# EAGLE schematic unitbase_anayuki (EAGLE 9.6.2)

## Sheet 1 of 3
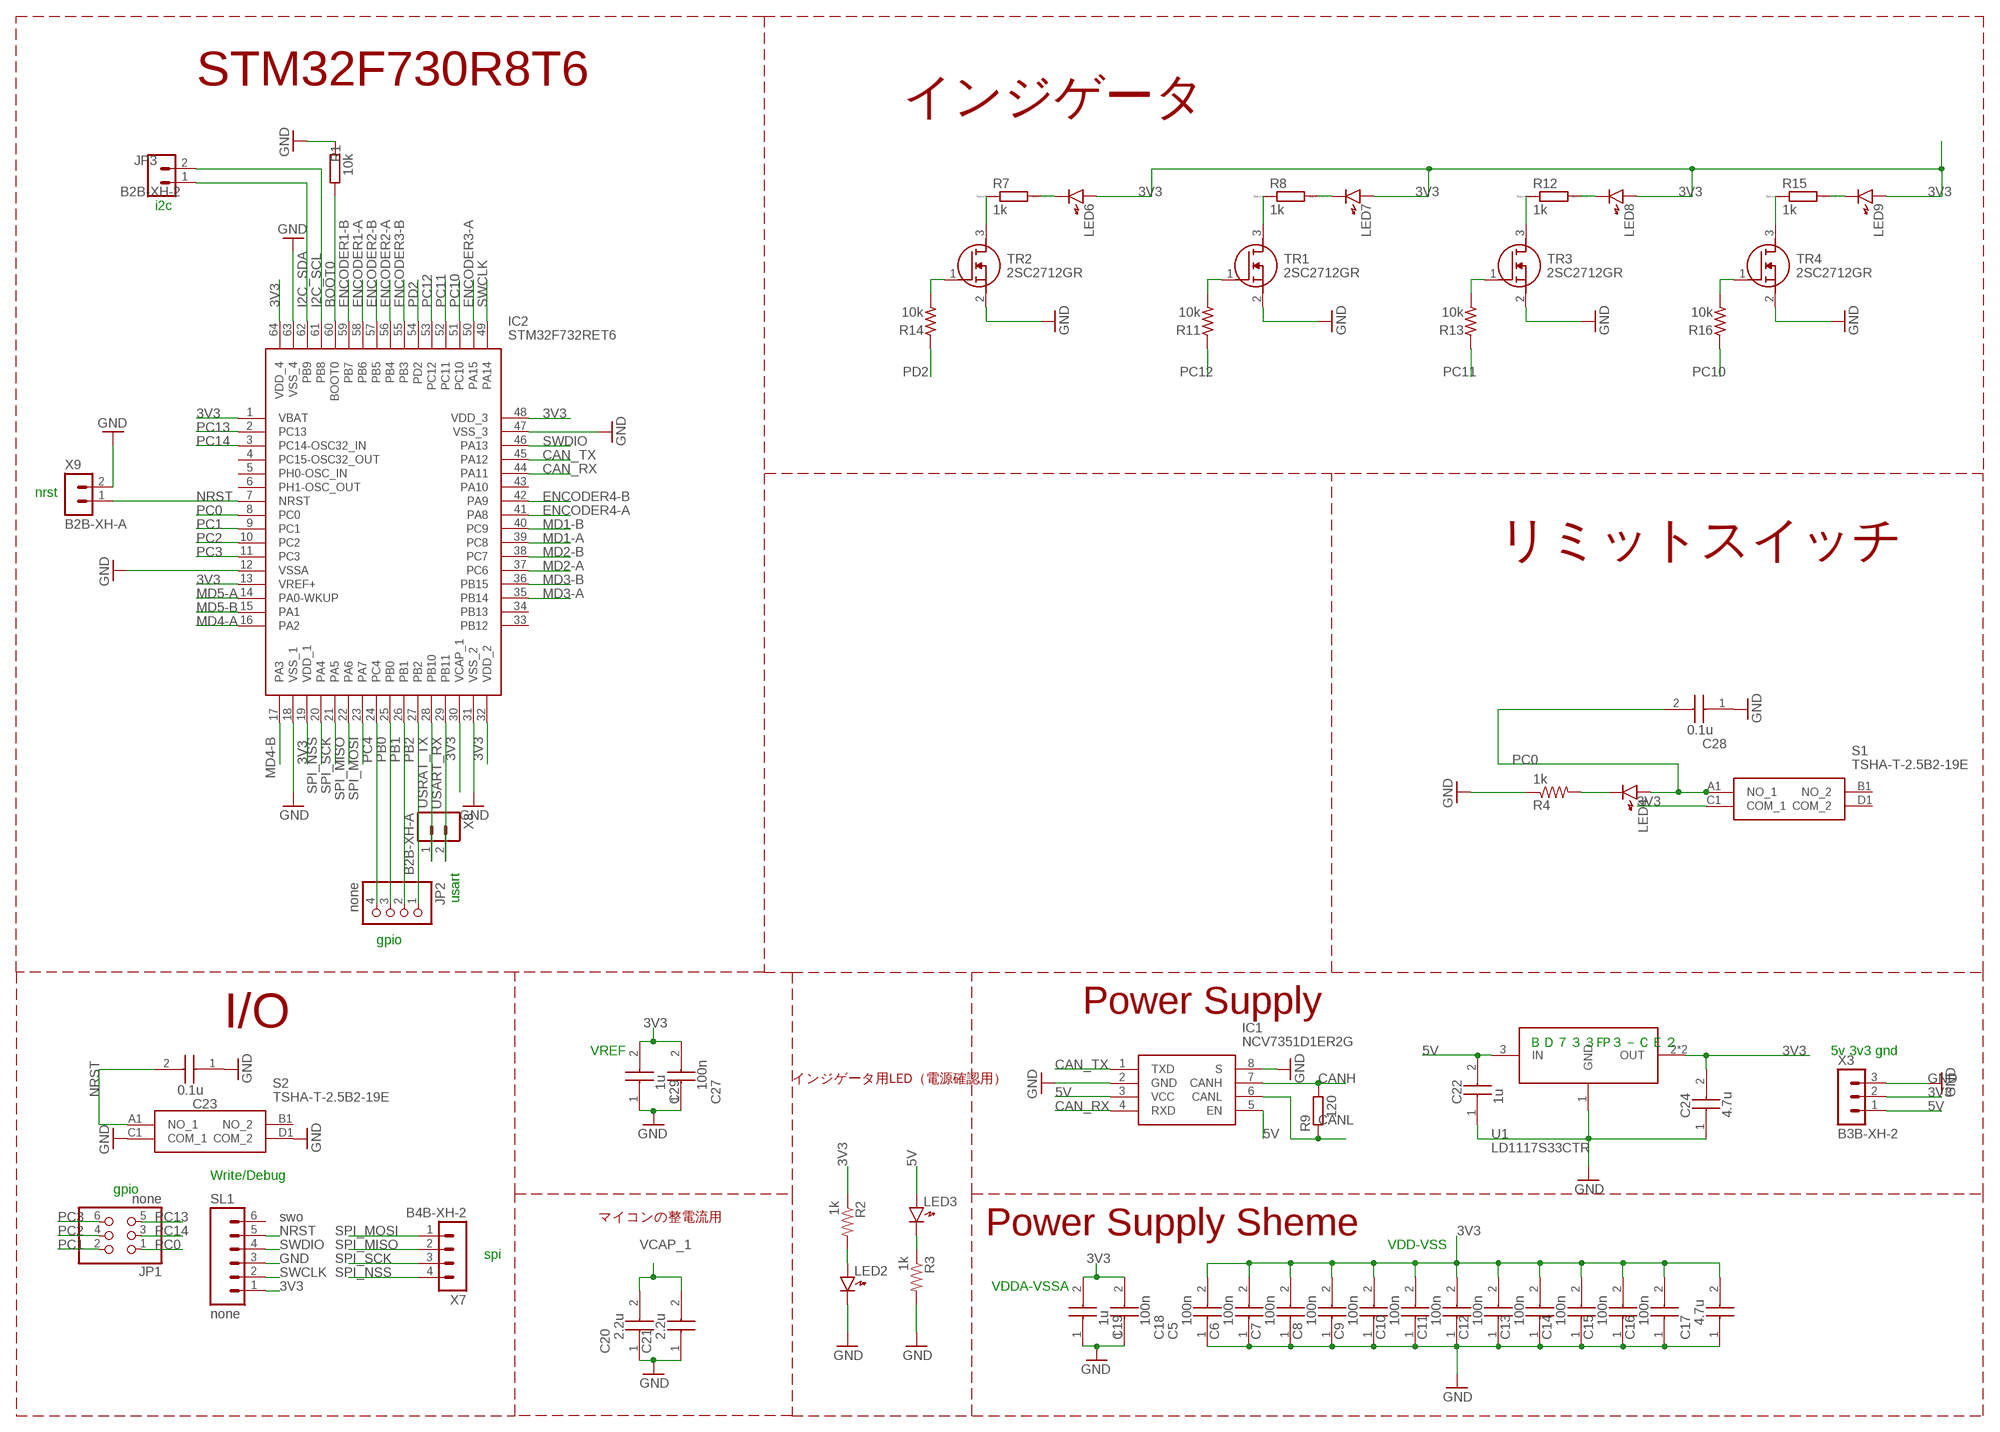
[diagram p0: schematic, sheet 1]

### Parts
C5  100n  AMK107BBJ476MA-RE  [CAPC1709X100N]
C6  100n  AMK107BBJ476MA-RE  [CAPC1709X100N]
C7  100n  AMK107BBJ476MA-RE  [CAPC1709X100N]
C8  100n  AMK107BBJ476MA-RE  [CAPC1709X100N]
C9  100n  AMK107BBJ476MA-RE  [CAPC1709X100N]
C10  100n  AMK107BBJ476MA-RE  [CAPC1709X100N]
C11  100n  AMK107BBJ476MA-RE  [CAPC1709X100N]
C12  100n  AMK107BBJ476MA-RE  [CAPC1709X100N]
C13  100n  AMK107BBJ476MA-RE  [CAPC1709X100N]
C14  100n  AMK107BBJ476MA-RE  [CAPC1709X100N]
C15  100n  AMK107BBJ476MA-RE  [CAPC1709X100N]
C16  100n  AMK107BBJ476MA-RE  [CAPC1709X100N]
C17  4.7u  AMK107BBJ476MA-RE  [CAPC1709X100N]
C18  100n  AMK107BBJ476MA-RE  [CAPC1709X100N]
C19  1u  AMK107BBJ476MA-RE  [CAPC1709X100N]
C20  2.2u  AMK107BBJ476MA-RE  [CAPC1709X100N]
C21  2.2u  AMK107BBJ476MA-RE  [CAPC1709X100N]
C22  1u  GRM188B31A106KE69D  [CAPC1608X90N]
C23  0.1u  AMK107BBJ476MA-RE  [CAPC1709X100N]
C24  4.7u  GRM188B31A106KE69D  [CAPC1608X90N]
C27  100n  AMK107BBJ476MA-RE  [CAPC1709X100N]
C28  0.1u  AMK107BBJ476MA-RE  [CAPC1709X100N]
C29  1u  AMK107BBJ476MA-RE  [CAPC1709X100N]
IC1  NCV7351D1ER2G  [SOIC127P600X175-8N]
IC2  STM32F732RET6  [QFP50P1200X1200X160-64N]
JP1  none  PINHD-2X3  [2X03]
JP2  none  PINHD-1X4  [1X04]
JP3  B2B-XH-2  [B2B-XH-A]
LED2  LED1608  [LED1608]
LED3  LED1608  [LED1608]
LED4  LED1608  [LED1608]
LED6  LED1608  [LED1608]
LED7  LED1608  [LED1608]
LED8  LED1608  [LED1608]
LED9  LED1608  [LED1608]
R1  10k  R1608  [1608]
R2  1k  R-US_R0603  [R0603]
R3  1k  R-US_R0603  [R0603]
R4  1k  R-US_R0603  [R0603]
R7  1k  RR0603  [R0603]
R8  1k  RR0603  [R0603]
R9  120  R1608  [1608]
R11  10k  RESISTOR-US1608  [SMD1608]
R12  1k  RR0603  [R0603]
R13  10k  RESISTOR-US1608  [SMD1608]
R14  10k  RESISTOR-US1608  [SMD1608]
R15  1k  RR0603  [R0603]
R16  10k  RESISTOR-US1608  [SMD1608]
S1  TSHA-T-2.5B2-19E  [TSHAT25B219E]
S2  TSHA-T-2.5B2-19E  [TSHAT25B219E]
SL1  none  MA06  [06PA]
TR1  2SC2712GR  SOT-23_NMOS  [SOT-23]
TR2  2SC2712GR  SOT-23_NMOS  [SOT-23]
TR3  2SC2712GR  SOT-23_NMOS  [SOT-23]
TR4  2SC2712GR  SOT-23_NMOS  [SOT-23]
U1  LD1117S33CTR  [SOT223]
X3  B3B-XH-2  [B3B-XH-A]
X7  B4B-XH-2  [B4B-XH-A]
X8  B2B-XH-A  [B2B-XH-A]
X9  B2B-XH-A  [B2B-XH-A]

### Nets
3V3: C5.2 C6.2 C7.2 C8.2 C9.2 C10.2 C11.2 C12.2 C13.2 C14.2 C15.2 C16.2 C17.2 C18.2 C19.2 C24.2 C27.2 C29.2 IC2.1(VBAT) IC2.13(VREF+) IC2.19(VDD_1) IC2.30(VCAP_1) IC2.32(VDD_2) IC2.48(VDD_3) IC2.64(VDD_4) LED6.A LED7.A LED8.A LED9.A R2.1 S1.C1(COM_1) SL1.1 U1.2(OUT) U1.4(OUT) X3.2 ; also sheet 3
5V: C22.2 IC1.3(VCC) IC1.5(EN) LED3.A U1.3(IN) X3.1 ; also sheet 2,3
BOOT0: IC2.60(BOOT0) R1.1
CAN_RX [CANRX/TX]: IC1.4(RXD) IC2.44(PA11)
CAN_TX [CANRX/TX]: IC1.1(TXD) IC2.45(PA12)
CANH [CAN]: IC1.7(CANH) R9.2 ; also sheet 3
CANL [CAN]: IC1.6(CANL) R9.1 ; also sheet 3
ENCODER1-A: IC2.58(PB6) ; also sheet 2
ENCODER1-B: IC2.59(PB7) ; also sheet 2
ENCODER2-A: IC2.56(PB4) ; also sheet 2
ENCODER2-B: IC2.57(PB5) ; also sheet 2
ENCODER3-A: IC2.50(PA15) ; also sheet 2
ENCODER3-B: IC2.55(PB3) ; also sheet 2
ENCODER4-A: IC2.41(PA8) ; also sheet 2
ENCODER4-B: IC2.42(PA9) ; also sheet 2
GND: C5.1 C6.1 C7.1 C8.1 C9.1 C10.1 C11.1 C12.1 C13.1 C14.1 C15.1 C16.1 C17.1 C18.1 C19.1 C20.1 C21.1 C22.1 C23.1 C24.1 C27.1 C28.1 C29.1 IC1.2(GND) IC1.8(S) IC2.12(VSSA) IC2.18(VSS_1) IC2.31(VSS_2) IC2.47(VSS_3) IC2.63(VSS_4) LED2.K R1.2 R3.2 R4.1 S2.C1(COM_1) S2.D1(COM_2) SL1.3 TR1.2(S) TR2.2(S) TR3.2(S) TR4.2(S) U1.1(GND) X3.3 X9.2 ; also sheet 2,3
I2C_SCL: IC2.61(PB8) JP3.2
I2C_SDA: IC2.62(PB9) JP3.1
MD1-A: IC2.39(PC8) ; also sheet 3
MD1-B: IC2.40(PC9) ; also sheet 3
MD2-A: IC2.37(PC6) ; also sheet 3
MD2-B: IC2.38(PC7) ; also sheet 3
MD3-A: IC2.35(PB14) ; also sheet 3
MD3-B: IC2.36(PB15) ; also sheet 3
MD4-A: IC2.16(PA2) ; also sheet 3
MD4-B: IC2.17(PA3) ; also sheet 3
MD5-A: IC2.14(PA0-WKUP) ; also sheet 3
MD5-B: IC2.15(PA1) ; also sheet 3
N$7: LED2.A R2.2
N$8: LED3.K R3.1
N$16: LED4.K R4.2
N$22: LED6.K R7.2
N$23: R14.2 TR2.1(G)
N$25: R7.1 TR2.3(D)
N$26: LED7.K R8.2
N$27: R11.2 TR1.1(G)
N$28: R8.1 TR1.3(D)
N$30: LED8.K R12.2
N$31: R13.2 TR3.1(G)
N$33: R12.1 TR3.3(D)
N$39: LED9.K R15.2
N$40: R16.2 TR4.1(G)
N$41: R15.1 TR4.3(D)
NRST: C23.2 IC2.7(NRST) S2.A1(NO_1) SL1.5 X9.1
PB0: IC2.25(PB0) JP2.3 ; also sheet 3
PB1: IC2.26(PB1) JP2.2 ; also sheet 3
PB2: IC2.27(PB2) JP2.1
PC0: C28.2 IC2.8(PC0) JP1.1 LED4.A S1.A1(NO_1)
PC1: IC2.9(PC1) JP1.2
PC2: IC2.10(PC2) JP1.4
PC3: IC2.11(PC3) JP1.6
PC4: IC2.24(PC4) JP2.4
PC10: IC2.51(PC10) R16.1
PC11: IC2.52(PC11) R13.1
PC12: IC2.53(PC12) R11.1
PC13: IC2.2(PC13) JP1.5
PC14: IC2.3(PC14-OSC32_IN) JP1.3
PD2: IC2.54(PD2) R14.1
SPI_MISO: IC2.22(PA6) X7.2
SPI_MOSI: IC2.23(PA7) X7.1
SPI_NSS: IC2.20(PA4) X7.4
SPI_SCK: IC2.21(PA5) X7.3
SWCLK: IC2.49(PA14) SL1.2
SWDIO: IC2.46(PA13) SL1.4
USART_RX: IC2.29(PB11) X8.2
USRAT_TX: IC2.28(PB10) X8.1
VCAP_1: C20.2 C21.2
Unconnected: IC2.4(PC15-OSC32_OUT) IC2.5(PH0-OSC_IN) IC2.6(PH1-OSC_OUT) IC2.33(PB12) IC2.34(PB13) IC2.43(PA10) S1.B1(NO_2) S1.D1(COM_2) S2.B1(NO_2) SL1.6

### Notes on the sheet
- STM32F730R8T6
- インジゲータ
- i2c
- nrst
- リミットスイッチ
- usart
- gpio
- Power Supply
- I/O
- ＢＤ７３３FP３－ＣＥ２
- VREF | 5v 3v3 gnd
- インジゲータ用LED（電源確認用）
- Write/Debug
- gpio
- swo | マイコンの整電流用
- Power Supply Sheme
- spi | VDD-VSS
- VDDA-VSSA

## Sheet 2 of 3
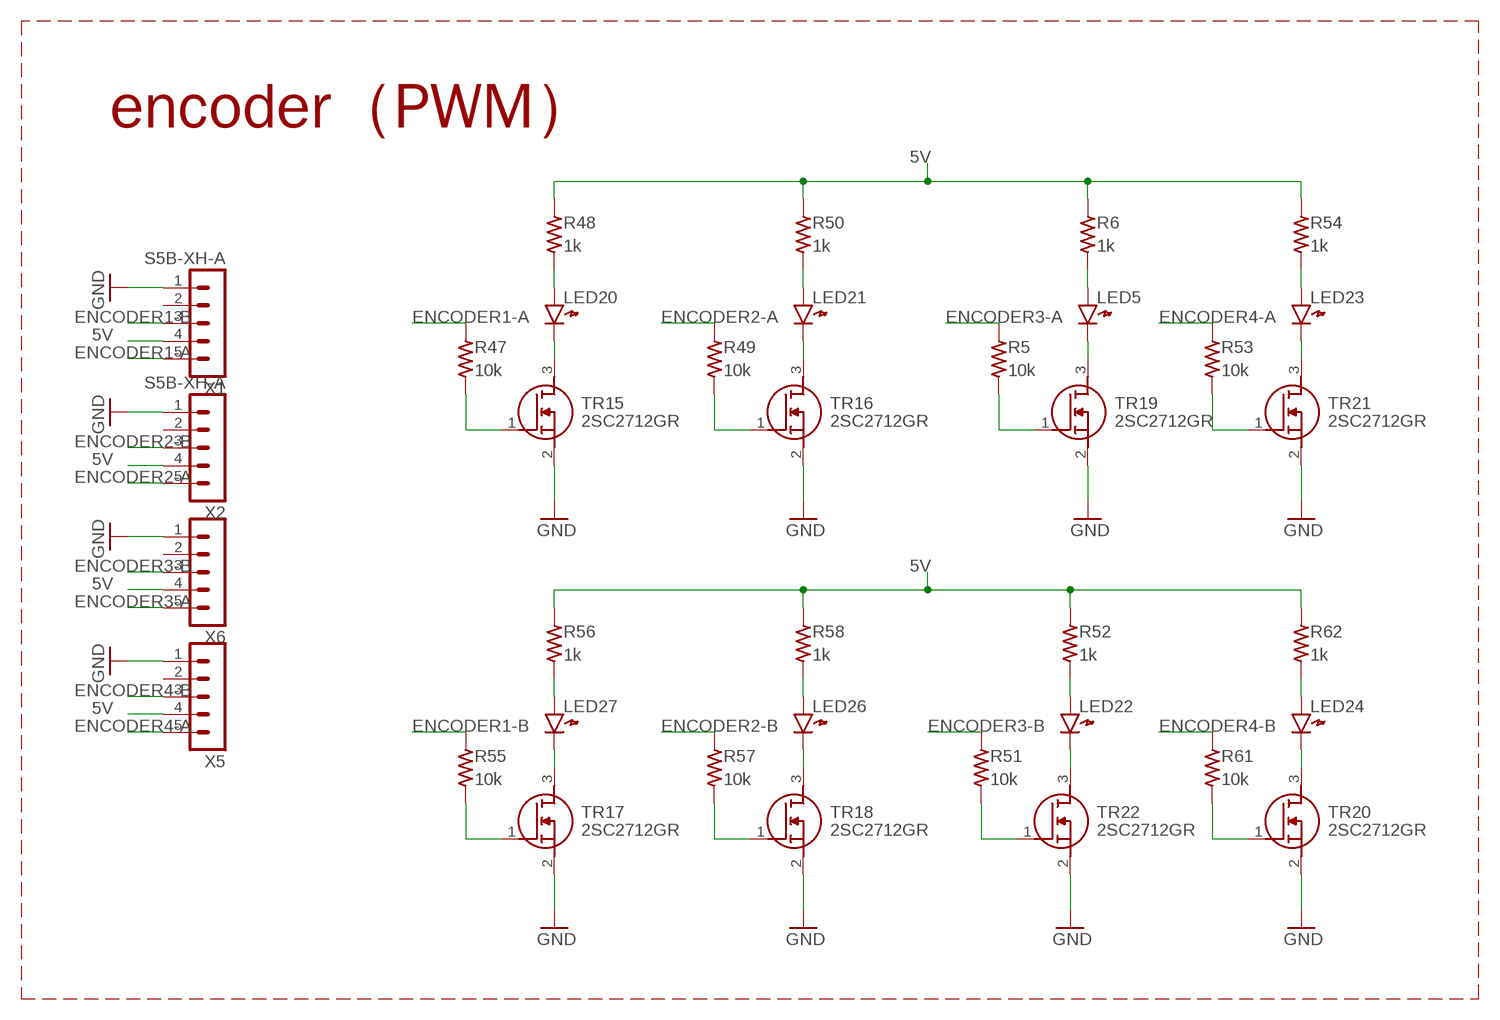
[diagram p1: schematic, sheet 2]

### Parts
LED5  LED1608  [LED1608]
LED20  LED1608  [LED1608]
LED21  LED1608  [LED1608]
LED22  LED1608  [LED1608]
LED23  LED1608  [LED1608]
LED24  LED1608  [LED1608]
LED26  LED1608  [LED1608]
LED27  LED1608  [LED1608]
R5  10k  RESISTOR-US1608  [SMD1608]
R6  1k  RESISTOR-US1608  [SMD1608]
R47  10k  RESISTOR-US1608  [SMD1608]
R48  1k  RESISTOR-US1608  [SMD1608]
R49  10k  RESISTOR-US1608  [SMD1608]
R50  1k  RESISTOR-US1608  [SMD1608]
R51  10k  RESISTOR-US1608  [SMD1608]
R52  1k  RESISTOR-US1608  [SMD1608]
R53  10k  RESISTOR-US1608  [SMD1608]
R54  1k  RESISTOR-US1608  [SMD1608]
R55  10k  RESISTOR-US1608  [SMD1608]
R56  1k  RESISTOR-US1608  [SMD1608]
R57  10k  RESISTOR-US1608  [SMD1608]
R58  1k  RESISTOR-US1608  [SMD1608]
R61  10k  RESISTOR-US1608  [SMD1608]
R62  1k  RESISTOR-US1608  [SMD1608]
TR15  2SC2712GR  SOT-23_NMOS  [SOT-23]
TR16  2SC2712GR  SOT-23_NMOS  [SOT-23]
TR17  2SC2712GR  SOT-23_NMOS  [SOT-23]
TR18  2SC2712GR  SOT-23_NMOS  [SOT-23]
TR19  2SC2712GR  SOT-23_NMOS  [SOT-23]
TR20  2SC2712GR  SOT-23_NMOS  [SOT-23]
TR21  2SC2712GR  SOT-23_NMOS  [SOT-23]
TR22  2SC2712GR  SOT-23_NMOS  [SOT-23]
X1  S5B-XH-A  [S5B-XH-A]
X2  S5B-XH-A  [S5B-XH-A]
X5  S5B-XH-A  [S5B-XH-A]
X6  S5B-XH-A  [S5B-XH-A]

### Nets
5V: R6.1 R48.1 R50.1 R52.1 R54.1 R56.1 R58.1 R62.1 X1.4 X2.4 X5.4 X6.4 ; also sheet 1,3
ENCODER1-A: R47.1 X1.5 ; also sheet 1
ENCODER1-B: R55.1 X1.3 ; also sheet 1
ENCODER2-A: R49.1 X2.5 ; also sheet 1
ENCODER2-B: R57.1 X2.3 ; also sheet 1
ENCODER3-A: R5.1 X6.5 ; also sheet 1
ENCODER3-B: R51.1 X6.3 ; also sheet 1
ENCODER4-A: R53.1 X5.5 ; also sheet 1
ENCODER4-B: R61.1 X5.3 ; also sheet 1
GND: TR15.2(S) TR16.2(S) TR17.2(S) TR18.2(S) TR19.2(S) TR20.2(S) TR21.2(S) TR22.2(S) X1.1 X2.1 X5.1 X6.1 ; also sheet 1,3
N$1: LED20.K TR15.3(D)
N$2: LED20.A R48.2
N$3: R49.2 TR16.1(G)
N$4: R47.2 TR15.1(G)
N$5: LED21.K TR16.3(D)
N$6: LED21.A R50.2
N$10: R53.2 TR21.1(G)
N$13: LED23.K TR21.3(D)
N$14: R5.2 TR19.1(G)
N$15: LED5.K TR19.3(D)
N$17: LED5.A R6.2
N$18: R51.2 TR22.1(G)
N$19: LED22.K TR22.3(D)
N$20: LED22.A R52.2
N$24: LED23.A R54.2
N$29: R55.2 TR17.1(G)
N$32: LED27.K TR17.3(D)
N$34: LED27.A R56.2
N$35: R57.2 TR18.1(G)
N$36: LED26.K TR18.3(D)
N$37: LED26.A R58.2
N$51: R61.2 TR20.1(G)
N$53: LED24.K TR20.3(D)
N$57: LED24.A R62.2
Unconnected: X1.2 X2.2 X5.2 X6.2

### Notes on the sheet
- encoder（PWM）

## Sheet 3 of 3
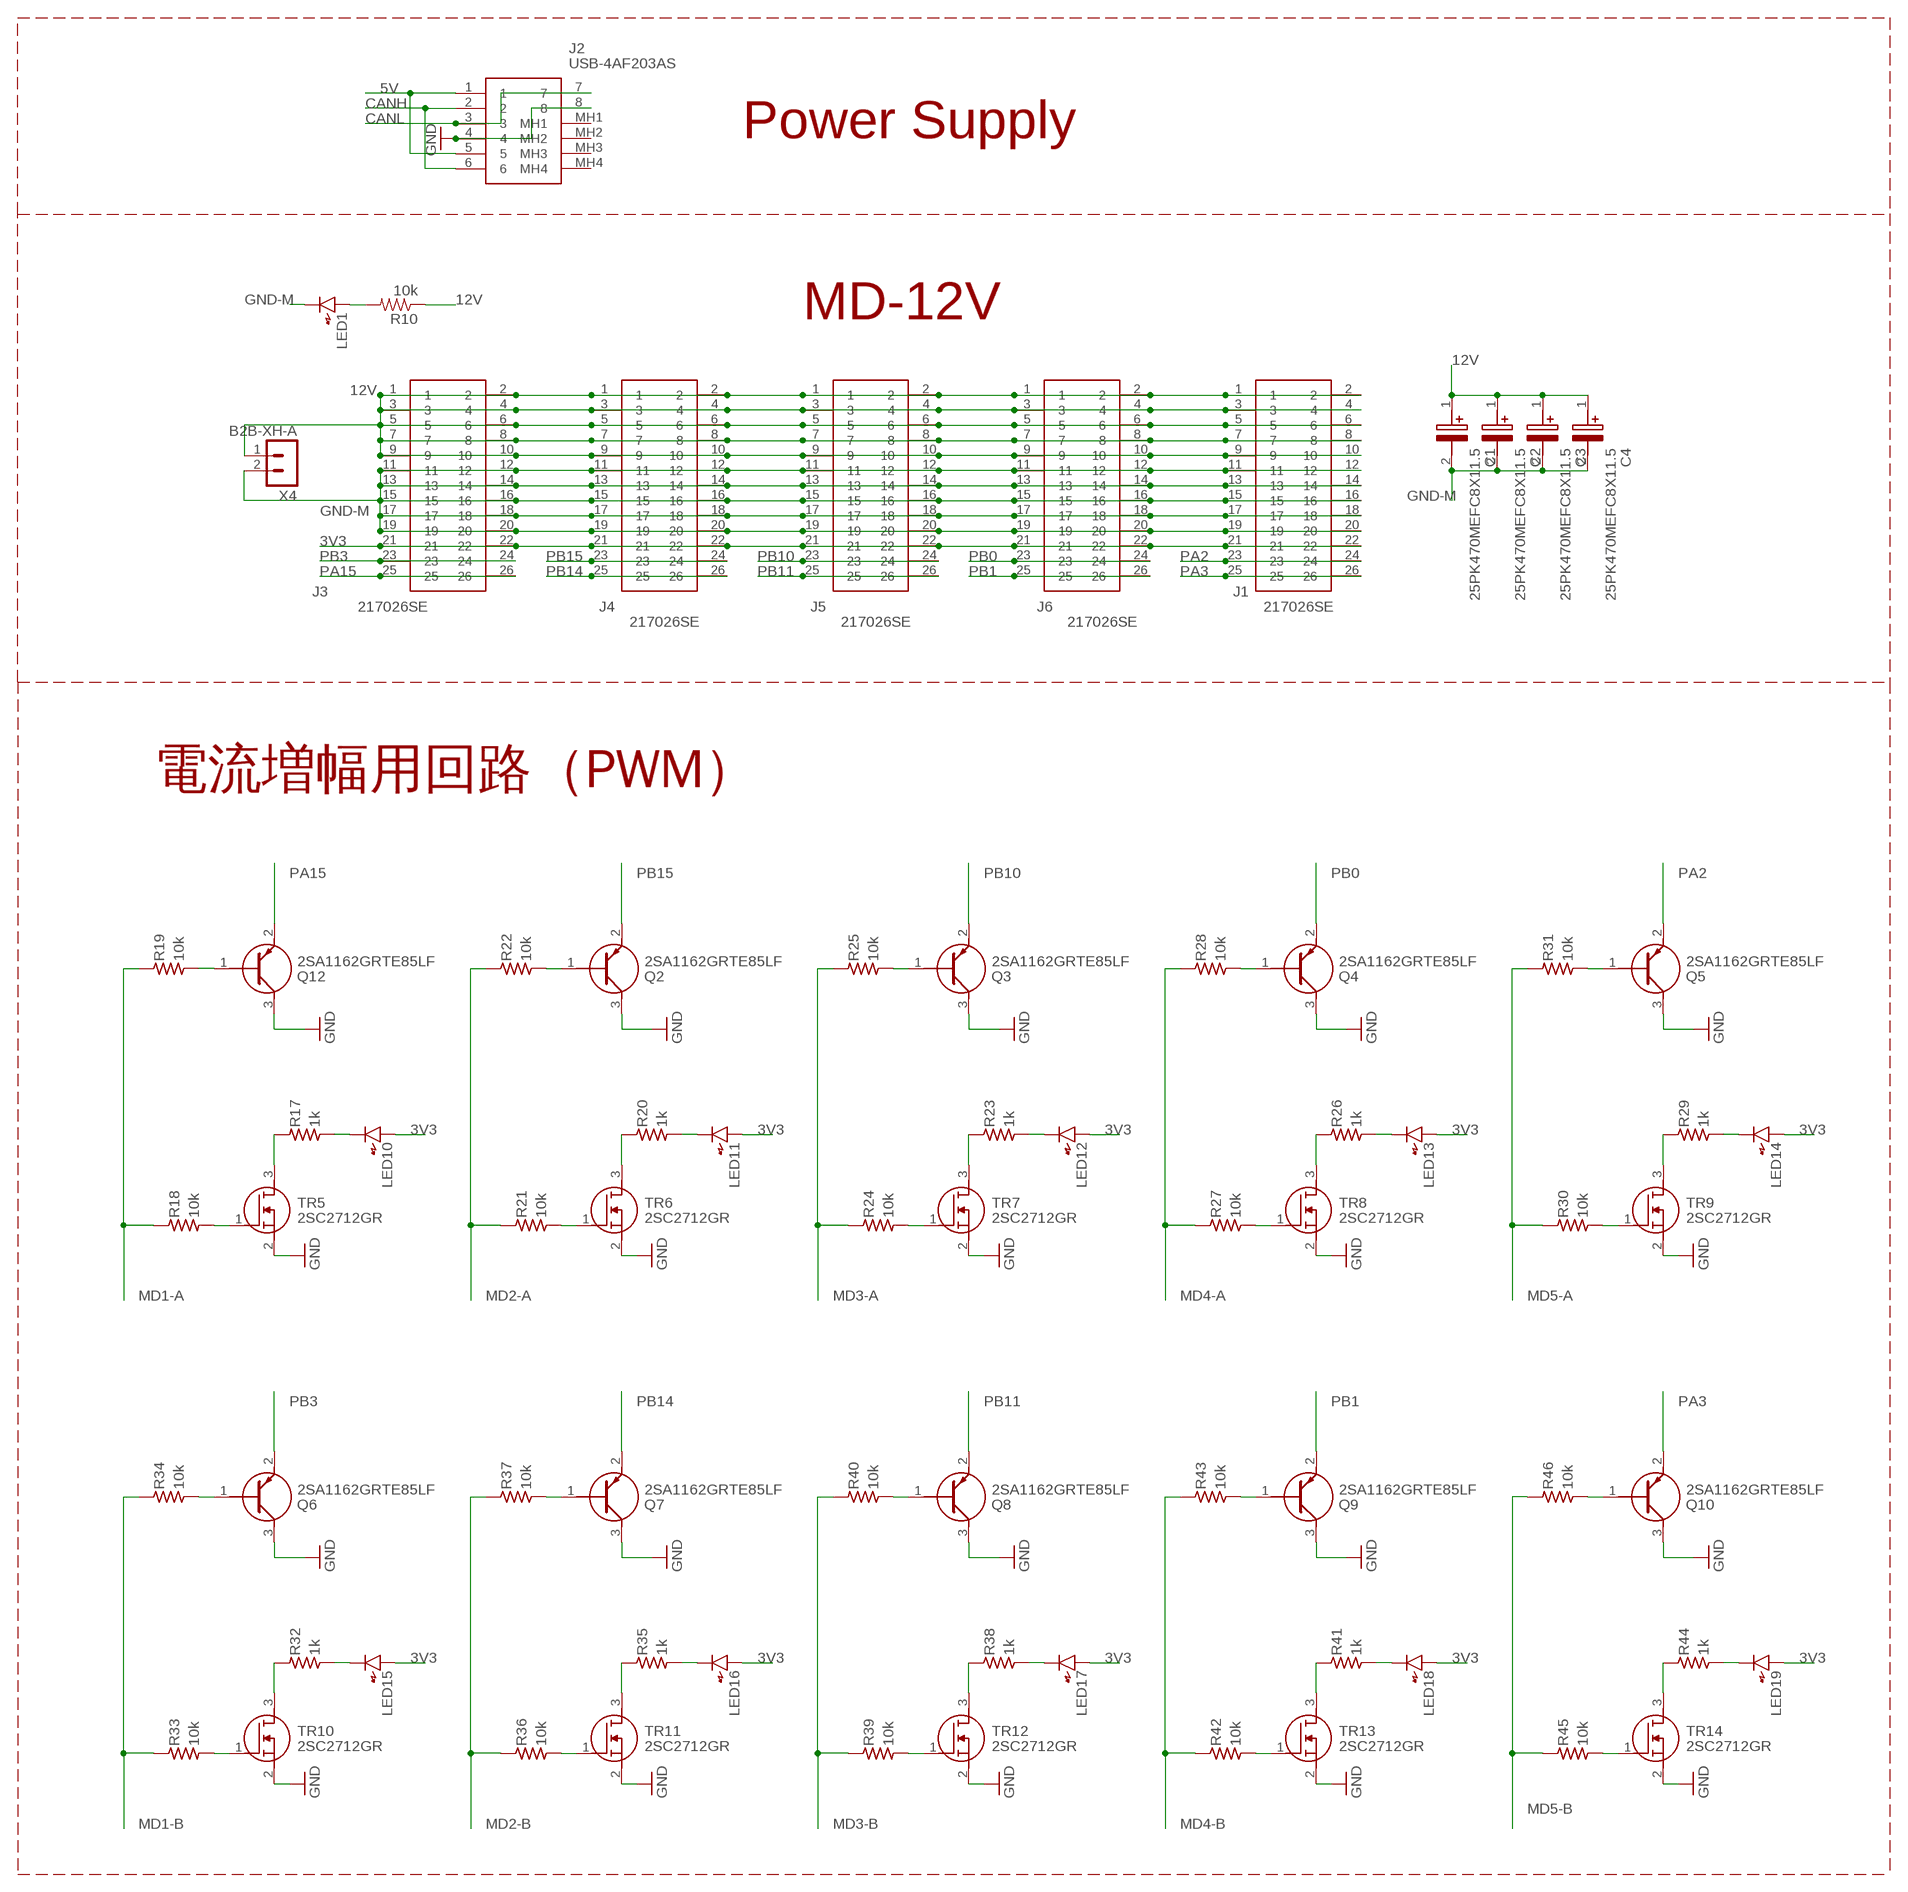
[diagram p2: schematic, sheet 3]

### Parts
C1  25PK470MEFC8X11.5  [CAPPRD350W60D825H1150]
C2  25PK470MEFC8X11.5  [CAPPRD350W60D825H1150]
C3  25PK470MEFC8X11.5  [CAPPRD350W60D825H1150]
C4  25PK470MEFC8X11.5  [CAPPRD350W60D825H1150]
J1  217026SE  [217026SE]
J2  USB-4AF203AS  [USB4AF203AS]
J3  217026SE  [217026SE]
J4  217026SE  [217026SE]
J5  217026SE  [217026SE]
J6  217026SE  [217026SE]
LED1  LED1608  [LED1608]
LED10  LED1608  [LED1608]
LED11  LED1608  [LED1608]
LED12  LED1608  [LED1608]
LED13  LED1608  [LED1608]
LED14  LED1608  [LED1608]
LED15  LED1608  [LED1608]
LED16  LED1608  [LED1608]
LED17  LED1608  [LED1608]
LED18  LED1608  [LED1608]
LED19  LED1608  [LED1608]
Q2  2SA1162GRTE85LF  [2SA1162GRTE85LF]
Q3  2SA1162GRTE85LF  [2SA1162GRTE85LF]
Q4  2SA1162GRTE85LF  [2SA1162GRTE85LF]
Q5  2SA1162GRTE85LF  [2SA1162GRTE85LF]
Q6  2SA1162GRTE85LF  [2SA1162GRTE85LF]
Q7  2SA1162GRTE85LF  [2SA1162GRTE85LF]
Q8  2SA1162GRTE85LF  [2SA1162GRTE85LF]
Q9  2SA1162GRTE85LF  [2SA1162GRTE85LF]
Q10  2SA1162GRTE85LF  [2SA1162GRTE85LF]
Q12  2SA1162GRTE85LF  [2SA1162GRTE85LF]
R10  10k  R-US_R0603  [R0603]
R17  1k  RESISTOR-US1608  [SMD1608]
R18  10k  RESISTOR-US1608  [SMD1608]
R19  10k  RESISTOR-US1608  [SMD1608]
R20  1k  RESISTOR-US1608  [SMD1608]
R21  10k  RESISTOR-US1608  [SMD1608]
R22  10k  RESISTOR-US1608  [SMD1608]
R23  1k  RESISTOR-US1608  [SMD1608]
R24  10k  RESISTOR-US1608  [SMD1608]
R25  10k  RESISTOR-US1608  [SMD1608]
R26  1k  RESISTOR-US1608  [SMD1608]
R27  10k  RESISTOR-US1608  [SMD1608]
R28  10k  RESISTOR-US1608  [SMD1608]
R29  1k  RESISTOR-US1608  [SMD1608]
R30  10k  RESISTOR-US1608  [SMD1608]
R31  10k  RESISTOR-US1608  [SMD1608]
R32  1k  RESISTOR-US1608  [SMD1608]
R33  10k  RESISTOR-US1608  [SMD1608]
R34  10k  RESISTOR-US1608  [SMD1608]
R35  1k  RESISTOR-US1608  [SMD1608]
R36  10k  RESISTOR-US1608  [SMD1608]
R37  10k  RESISTOR-US1608  [SMD1608]
R38  1k  RESISTOR-US1608  [SMD1608]
R39  10k  RESISTOR-US1608  [SMD1608]
R40  10k  RESISTOR-US1608  [SMD1608]
R41  1k  RESISTOR-US1608  [SMD1608]
R42  10k  RESISTOR-US1608  [SMD1608]
R43  10k  RESISTOR-US1608  [SMD1608]
R44  1k  RESISTOR-US1608  [SMD1608]
R45  10k  RESISTOR-US1608  [SMD1608]
R46  10k  RESISTOR-US1608  [SMD1608]
TR5  2SC2712GR  SOT-23_NMOS  [SOT-23]
TR6  2SC2712GR  SOT-23_NMOS  [SOT-23]
TR7  2SC2712GR  SOT-23_NMOS  [SOT-23]
TR8  2SC2712GR  SOT-23_NMOS  [SOT-23]
TR9  2SC2712GR  SOT-23_NMOS  [SOT-23]
TR10  2SC2712GR  SOT-23_NMOS  [SOT-23]
TR11  2SC2712GR  SOT-23_NMOS  [SOT-23]
TR12  2SC2712GR  SOT-23_NMOS  [SOT-23]
TR13  2SC2712GR  SOT-23_NMOS  [SOT-23]
TR14  2SC2712GR  SOT-23_NMOS  [SOT-23]
X4  B2B-XH-A  [B2B-XH-A]

### Nets
3V3: J1.21 J1.22 J3.21 J3.22 J4.21 J4.22 J5.21 J5.22 J6.21 J6.22 LED10.A LED11.A LED12.A LED13.A LED14.A LED15.A LED16.A LED17.A LED18.A LED19.A ; also sheet 1
5V: J2.1 J2.5 ; also sheet 1,2
12V: C1.1(+) C2.1(+) C3.1(+) C4.1(+) J1.1 J1.2 J1.3 J1.4 J1.5 J1.6 J1.7 J1.8 J1.9 J1.10 J3.1 J3.2 J3.3 J3.4 J3.5 J3.6 J3.7 J3.8 J3.9 J3.10 J4.1 J4.2 J4.3 J4.4 J4.5 J4.6 J4.7 J4.8 J4.9 J4.10 J5.1 J5.2 J5.3 J5.4 J5.5 J5.6 J5.7 J5.8 J5.9 J5.10 J6.1 J6.2 J6.3 J6.4 J6.5 J6.6 J6.7 J6.8 J6.9 J6.10 R10.1 X4.1
CANH [CAN]: J2.2 J2.6 ; also sheet 1
CANL [CAN]: J2.3 J2.7 ; also sheet 1
GND: J2.4 J2.8 Q2.3(C) Q3.3(C) Q4.3(C) Q5.3(C) Q6.3(C) Q7.3(C) Q8.3(C) Q9.3(C) Q10.3(C) Q12.3(C) TR5.2(S) TR6.2(S) TR7.2(S) TR8.2(S) TR9.2(S) TR10.2(S) TR11.2(S) TR12.2(S) TR13.2(S) TR14.2(S) ; also sheet 1,2
GND-M: C1.2(-) C2.2(-) C3.2(-) C4.2(-) J1.11 J1.12 J1.13 J1.14 J1.15 J1.16 J1.17 J1.18 J1.19 J1.20 J3.11 J3.12 J3.13 J3.14 J3.15 J3.16 J3.17 J3.18 J3.19 J3.20 J4.11 J4.12 J4.13 J4.14 J4.15 J4.16 J4.17 J4.18 J4.19 J4.20 J5.11 J5.12 J5.13 J5.14 J5.15 J5.16 J5.17 J5.18 J5.19 J5.20 J6.11 J6.12 J6.13 J6.14 J6.15 J6.16 J6.17 J6.18 J6.19 J6.20 LED1.K X4.2
MD1-A: R18.1 R19.1 ; also sheet 1
MD1-B: R33.1 R34.1 ; also sheet 1
MD2-A: R21.1 R22.1 ; also sheet 1
MD2-B: R36.1 R37.1 ; also sheet 1
MD3-A: R24.1 R25.1 ; also sheet 1
MD3-B: R39.1 R40.1 ; also sheet 1
MD4-A: R27.1 R28.1 ; also sheet 1
MD4-B: R42.1 R43.1 ; also sheet 1
MD5-A: R30.1 R31.1 ; also sheet 1
MD5-B: R45.1 R46.1 ; also sheet 1
N$12: LED1.A R10.2
N$42: R17.1 TR5.3(D)
N$43: R18.2 TR5.1(G)
N$44: LED10.K R17.2
N$45: Q12.1(B) R19.2
N$47: R20.1 TR6.3(D)
N$49: R21.2 TR6.1(G)
N$50: LED11.K R20.2
N$52: Q2.1(B) R22.2
N$54: R23.1 TR7.3(D)
N$55: R24.2 TR7.1(G)
N$56: LED12.K R23.2
N$58: Q3.1(B) R25.2
N$60: R26.1 TR8.3(D)
N$61: R27.2 TR8.1(G)
N$62: LED13.K R26.2
N$64: Q4.1(B) R28.2
N$66: R29.1 TR9.3(D)
N$67: R30.2 TR9.1(G)
N$68: LED14.K R29.2
N$70: Q5.1(B) R31.2
N$72: R32.1 TR10.3(D)
N$73: R33.2 TR10.1(G)
N$74: LED15.K R32.2
N$76: Q6.1(B) R34.2
N$78: R35.1 TR11.3(D)
N$79: R36.2 TR11.1(G)
N$80: LED16.K R35.2
N$82: Q7.1(B) R37.2
N$84: R38.1 TR12.3(D)
N$85: R39.2 TR12.1(G)
N$86: LED17.K R38.2
N$88: Q8.1(B) R40.2
N$90: R41.1 TR13.3(D)
N$91: R42.2 TR13.1(G)
N$92: LED18.K R41.2
N$94: Q9.1(B) R43.2
N$96: R44.1 TR14.3(D)
N$97: R45.2 TR14.1(G)
N$98: LED19.K R44.2
N$100: Q10.1(B) R46.2
PA2: J1.23 J1.24 Q5.2(E)
PA3: J1.25 J1.26 Q10.2(E)
PA15: J3.25 J3.26 Q12.2(E)
PB0: J6.23 J6.24 Q4.2(E) ; also sheet 1
PB1: J6.25 J6.26 Q9.2(E) ; also sheet 1
PB3: J3.23 J3.24 Q6.2(E)
PB10: J5.23 J5.24 Q3.2(E)
PB11: J5.25 J5.26 Q8.2(E)
PB14: J4.25 J4.26 Q7.2(E)
PB15: J4.23 J4.24 Q2.2(E)
Unconnected: J2.MH1 J2.MH2 J2.MH3 J2.MH4

### Notes on the sheet
- Power Supply
- MD-12V
- 電流増幅用回路（PWM）

## Library data of the parts
C1-C4 = SamacSys_Parts:25PK470MEFC8X11.5: Rubycon 470uF 25 V dc Aluminium Electrolytic Capacitor, PK Series 2000h 8 Dia. x 11.5mm Source: Datasheet <http://www.rubycon.co.jp/en/catalog/e_pdfs/aluminum/e_pk.pdf>; DESCRIPTION: Rubycon 470uF 25 V dc Aluminium Electrolytic Capacitor, PK Series 2000h 8 Dia. x 11.5mm; HEIGHT: 11.5mm; MANUFACTURER_NAME: Rubycon; MANUFACTURER_PART_NUMBER: 25PK470MEFC8X11.5; MOUSER_PART_NUMBER: 232-25PK470MEFC8X115; MOUSER_PRICE-STOCK: https://www.mouser.co.uk/ProductDetail/Rubycon/25PK470MEFC8X115?qs=T3oQrply3y%252BFwMonqVFqXg%3D%3D
C5-C21 C23 C27-C29 = SamacSys_Parts:AMK107BBJ476MA-RE: 0603 (1608M) 47uF MLCC 4V dc +/-20% SMD Source: Datasheet <https://ds.yuden.co.jp/TYCOMPAS/ut/detail?pn=AMK107BBJ476MA-RE&u=M>; DESCRIPTION: 0603 (1608M) 47uF MLCC 4V dc +/-20% SMD; HEIGHT: 1mm; MANUFACTURER_NAME: TAIYO YUDEN; MANUFACTURER_PART_NUMBER: AMK107BBJ476MA-RE; MOUSER_PART_NUMBER: 963-AMK107BBJ476MARE; MOUSER_PRICE-STOCK: https://www.mouser.com/Search/Refine.aspx?Keyword=963-AMK107BBJ476MARE; RS_PART_NUMBER: 1843762P; RS_PRICE-STOCK: http://uk.rs-online.com/web/p/products/1843762P
C22 C24 = SamacSys_Parts:GRM188B31A106KE69D: Murata 1608 GRM 10000nF Ceramic Multilayer Capacitor, 10 V dc, +85C, B Dielectric, +/-10% Source: Datasheet <http://www.murata.com/~/media/webrenewal/support/library/catalog/products/capacitor/mlcc/c02e.pdf>; DESCRIPTION: Murata 1608 GRM 10000nF Ceramic Multilayer Capacitor, 10 V dc, +85C, B Dielectric, +/-10%; HEIGHT: 0.9mm; MANUFACTURER_NAME: Murata Electronics; MANUFACTURER_PART_NUMBER: GRM188B31A106KE69D; RS_PART_NUMBER: 8847157P; RS_PRICE-STOCK: http://uk.rs-online.com/web/p/products/8847157P
IC1 = SamacSys_Parts:NCV7351D1ER2G: ON Semiconductor NCV7351D1ER2G, CAN Transceiver 1Mbit/s 1-channel ISO 11898-2, 8-Pin SOIC Source: Datasheet <http://www.onsemi.com/pub/Collateral/NCV7351-D.PDF>; ARROW_PART_NUMBER: NCV7351D1ER2G; ARROW_PRICE-STOCK: https://www.arrow.com/en/products/ncv7351d1er2g/on-semiconductor; DESCRIPTION: ON Semiconductor NCV7351D1ER2G, CAN Transceiver 1Mbit/s 1-channel ISO 11898-2, 8-Pin SOIC; HEIGHT: 1.75mm; MANUFACTURER_NAME: ON Semiconductor; MANUFACTURER_PART_NUMBER: NCV7351D1ER2G; MOUSER_PART_NUMBER: 863-NCV7351D1ER2G; MOUSER_PRICE-STOCK: https://www.mouser.co.uk/ProductDetail/ON-Semiconductor/NCV7351D1ER2G?qs=l5F7KFZg3O5tNFBk2wxDRg%3D%3D
IC2 = SamacSys_Parts:STM32F732RET6: STMICROELECTRONICS - STM32F732RET6 - MCU, ARM CORTEX-M7, 216MHZ, LQFP-64 Source: Datasheet <https://www.st.com/resource/en/datasheet/stm32f732re.pdf>; ARROW_PART_NUMBER: STM32F732RET6; ARROW_PRICE-STOCK: https://www.arrow.com/en/products/stm32f732ret6/stmicroelectronics?region=nac; DESCRIPTION: STMICROELECTRONICS - STM32F732RET6 - MCU, ARM CORTEX-M7, 216MHZ, LQFP-64; HEIGHT: 1.6mm; MANUFACTURER_NAME: STMicroelectronics; MANUFACTURER_PART_NUMBER: STM32F732RET6; MOUSER_PART_NUMBER: 511-STM32F732RET6; MOUSER_PRICE-STOCK: https://www.mouser.co.uk/ProductDetail/STMicroelectronics/STM32F732RET6?qs=ObEXV34I18OJOCW3Zu7wxw%3D%3D
J1 J3-J6 = maya_common:217026SE
J2 = SamacSys_Parts:USB-4AF203AS: USB Connector, A type Female, Dual Port 4P x 2 Stacked, Right Angle type. Source: Datasheet <http://akizukidenshi.com/download/ds/useconn/USB-4AF203AS-CT.PDF>; DESCRIPTION: USB Connector, A type Female, Dual Port 4P x 2 Stacked, Right Angle type.; HEIGHT: 15.5mm; MANUFACTURER_NAME: Useconn Electronics; MANUFACTURER_PART_NUMBER: USB-4AF203AS
JP1 = pinhead:PINHD-2X3: PIN HEADER
JP2 = pinhead:PINHD-1X4: PIN HEADER
JP3 X4 X8 X9 = con-JST_XH:B2B-XH: JST XH series header 2.50mm pitch disconnectable crimp style connectors, vertical (side entry type), 2 pins
LED1-LED24 LED26 LED27 = generic:LED: Generic LEDs
Q2-Q10 Q12 = SamacSys_Parts:2SA1162GRTE85LF: TOSHIBA Transistor Silicon PNP Epitaxial Type (PCT process) Source: Datasheet <https://www.arrow.com/en/products/2sa1162-gr-te85lf/toshiba>; ARROW_PART_NUMBER: 2SA1162GRTE85LF; ARROW_PRICE-STOCK: https://www.arrow.com/en/products/2sa1162-gr-te85lf/toshiba; DESCRIPTION: TOSHIBA Transistor Silicon PNP Epitaxial Type (PCT process); HEIGHT: 1.56mm; MANUFACTURER_NAME: Toshiba; MANUFACTURER_PART_NUMBER: 2SA1162GRTE85LF
R1 R9 = 1608:R1608
R2-R4 R10 = audio amplifier example:R-US_: RESISTOR, American symbol
R5 R6 R11 R13 R14 R16-R58 R61 R62 = generic:RESISTOR-US: Generic Registor
R7 R8 R12 R15 = eagle-ltspice:R: RESISTOR, European symbol; SPICEMODEL: NONE; SPICEPREFIX: R
S1 S2 = SamacSys_Parts:TSHA-T-2.5B2-19E: Switch Source: Datasheet <http://akizukidenshi.com/download/ds/topup/TSHA-T-2.5B2-19E.pdf>; DESCRIPTION: Switch; HEIGHT: 2.5mm; MANUFACTURER_NAME: Akizuki Denshi Tsusho; MANUFACTURER_PART_NUMBER: TSHA-T-2.5B2-19E
SL1 = con-amp-quick:MA06: AMP QUICK CONNECTOR; OC_FARNELL: unknown; OC_NEWARK: unknown
TR1-TR22 = maya_smd:SOT-23_NMOS
U1 = LD1117S33CTR:LD1117S33CTR: http://octopart.com/ld1117s33tr-stmicroelectronics-526708; AVAILABILITY: Unavailable; DESCRIPTION: LD1117 Series 1300 mA 3.3 V Fixed Output Positive Voltage LDO Regulator- SOT-223; MF: STMicroelectronics; MP: LD1117S33CTR; PACKAGE: SOT-223 STMicroelectronics; PRICE: None
X1 X2 X5 X6 = con-JST XH:S5B-XH: JST XH series header 2.50mm pitch disconnectable crimp style connectors, horizontal (side entry type), 5 pins
X3 = con-JST_XH:B3B-XH: JST XH series header 2.50mm pitch disconnectable crimp style connectors, vertical (side entry type), 3 pins
X7 = con-JST_XH:B4B-XH: JST XH series header 2.50mm pitch disconnectable crimp style connectors, vertical (side entry type), 4 pins